# EAGLE design SandeepEtchASketch (EAGLE 9.6.2)
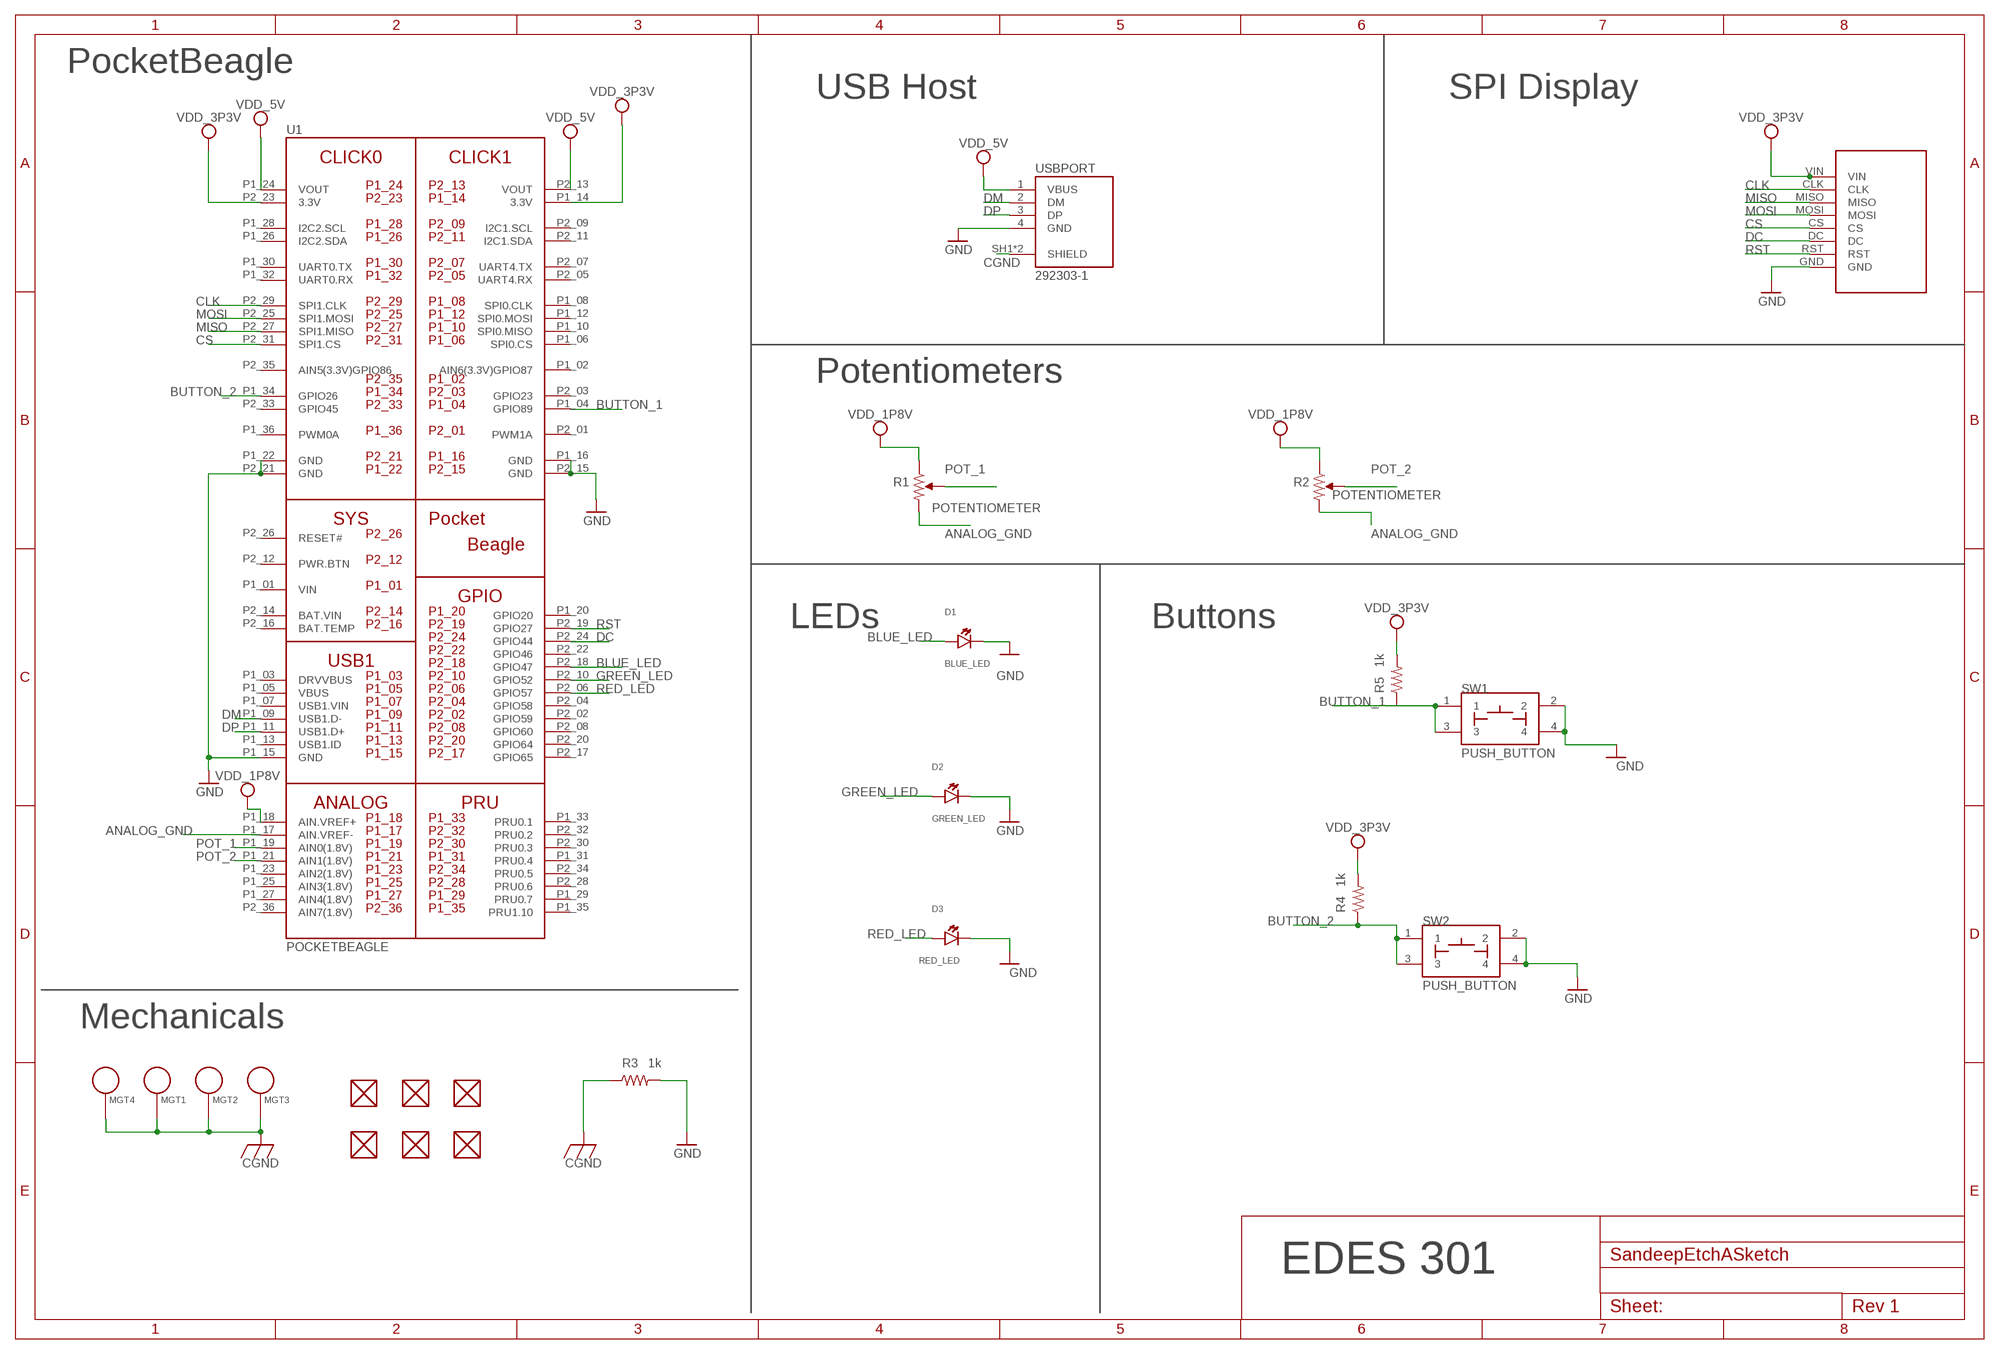
[diagram p0: schematic, sheet 1]

## Parts
D1  BLUE_LED  LED  [EIA-STD]
D2  GREEN_LED  LED  [EIA-STD]
D3  RED_LED  LED  [EIA-STD]
FUD1  FIDUCIAL  [FIDUCIAL_40MIL]
FUD2  FIDUCIAL  [FIDUCIAL_40MIL]
FUD3  FIDUCIAL  [FIDUCIAL_40MIL]
FUD4  FIDUCIAL  [FIDUCIAL_40MIL]
FUD5  FIDUCIAL  [FIDUCIAL_40MIL]
FUD6  FIDUCIAL  [FIDUCIAL_40MIL]
MGT1  MOUNTING_HOLE  [MOUNTING_HOLE]
MGT2  MOUNTING_HOLE  [MOUNTING_HOLE]
MGT3  MOUNTING_HOLE  [MOUNTING_HOLE]
MGT4  MOUNTING_HOLE  [MOUNTING_HOLE]
R1  POTENTIOMETER  [POT-PO90S]
R2  POTENTIOMETER  [POT-PO90S]
R3  1k  R_R0603  [R0603]
R4  1k  R_R0603  [R0603]
R5  1k  R_R0603  [R0603]
SPIDISPLAY  SCREEN  [SCREEN]
SW1  PUSH_BUTTON  [BUTTON_12.5MM]
SW2  PUSH_BUTTON  [BUTTON_12.5MM]
U1  POCKETBEAGLE  [POCKETBEAGLE]
USBPORT  292303-1  [TE_292303-1]

## Nets
ANALOG_GND: R1.CW R2.CW U1.P1_17(AIN.VREF-)
BLUE_LED: D1.ANODE U1.P2_18(GPIO47)
BUTTON_1: R5.1 SW1.1 SW1.3 U1.P1_04(GPIO89)
BUTTON_2: R4.1 SW2.1 SW2.3 U1.P1_34(GPIO26)
CGND: MGT1.P$1 MGT2.P$1 MGT3.P$1 MGT4.P$1 R3.1 USBPORT.SH1(SHIELD) USBPORT.SH2(SHIELD)
CLK: SPIDISPLAY.CLK U1.P2_29(SPI1.CLK)
CS: SPIDISPLAY.CS U1.P2_31(SPI1.CS)
DC: SPIDISPLAY.DC U1.P2_24(GPIO44)
DM: U1.P1_09(USB1.D-) USBPORT.2(DM)
DP: U1.P1_11(USB1.D+) USBPORT.3(DP)
GND: D1.CATHODE D2.CATHODE D3.CATHODE R3.2 SPIDISPLAY.GND SW1.2 SW1.4 SW2.2 SW2.4 U1.P1_15(GND) U1.P1_16(GND) U1.P1_22(GND) U1.P2_15(GND) U1.P2_21(GND) USBPORT.4(GND)
GREEN_LED: D2.ANODE U1.P2_10(GPIO52)
MISO: SPIDISPLAY.MISO U1.P2_27(SPI1.MISO)
MOSI: SPIDISPLAY.MOSI U1.P2_25(SPI1.MOSI)
POT_1: R1.S U1.P1_19(AIN0(1.8V))
POT_2: R2.S U1.P1_21(AIN1(1.8V))
RED_LED: D3.ANODE U1.P2_06(GPIO57)
RST: SPIDISPLAY.RST U1.P2_19(GPIO27)
VDD_1P8V: R1.CCW R2.CCW U1.P1_18(AIN.VREF+)
VDD_3P3V: R4.2 R5.2 SPIDISPLAY.VIN U1.P1_14(3.3V) U1.P2_23(3.3V)
VDD_5V: U1.P1_24(VOUT) U1.P2_13(VOUT) USBPORT.1(VBUS)
Unconnected: FUD1.P$1 FUD2.P$1 FUD3.P$1 FUD4.P$1 FUD5.P$1 FUD6.P$1 U1.P1_02(AIN6(3.3V)GPIO87) U1.P1_03(DRVVBUS) U1.P1_05(VBUS) U1.P1_06(SPI0.CS) U1.P1_07(USB1.VIN) U1.P1_08(SPI0.CLK) U1.P1_10(SPI0.MISO) U1.P1_12(SPI0.MOSI) U1.P1_13(USB1.ID) U1.P1_20(GPIO20) U1.P1_23(AIN2(1.8V)) U1.P1_25(AIN3(1.8V)) U1.P1_26(I2C2.SDA) U1.P1_27(AIN4(1.8V)) U1.P1_28(I2C2.SCL) U1.P1_29(PRU0.7) U1.P1_30(UART0.TX) U1.P1_31(PRU0.4) U1.P1_32(UART0.RX) U1.P1_33(PRU0.1) U1.P1_35(PRU1.10) U1.P1_36(PWM0A) U1.P2_01(PWM1A) U1.P2_02(GPIO59) U1.P2_03(GPIO23) U1.P2_04(GPIO58) U1.P2_05(UART4.RX) U1.P2_07(UART4.TX) U1.P2_08(GPIO60) U1.P2_09(I2C1.SCL) U1.P2_11(I2C1.SDA) U1.P2_12(PWR.BTN) U1.P2_16(BAT.TEMP) U1.P2_17(GPIO65) U1.P2_20(GPIO64) U1.P2_22(GPIO46) U1.P2_26(RESET#) U1.P2_28(PRU0.6) U1.P2_30(PRU0.3) U1.P2_32(PRU0.2) U1.P2_33(GPIO45) U1.P2_34(PRU0.5) U1.P2_35(AIN5(3.3V)GPIO86) U1.P2_36(AIN7(1.8V))

## Notes on the sheet
- PocketBeagle
- USB Host | SPI Display
- Potentiometers
- LEDs | Buttons
- Mechanicals
- EDES 301

## Power pins joined to a net without a drawn wire
BAT.VIN: U1.P2_14(BAT.VIN)
VIN: U1.P1_01(VIN)

## Library data of the parts
D1-D3 = Etch_A_Sketch:LED: EIA-STD LED, LTST-C191TBKT
FUD1-FUD6 = Etch_A_Sketch:FIDUCIAL
MGT1-MGT4 = Etch_A_Sketch:MOUNTING_HOLE: Chassis Mounting Hole w/GND connection ability
R1 R2 = Etch_A_Sketch:POTENTIOMETER: Potentiometer - Examples: P090S-14T20BR10K (987-1277-ND)
R3-R5 = Etch_A_Sketch:R_: RESISTOR, American symbol
SPIDISPLAY = Etch_A_Sketch:SCREEN
SW1 SW2 = Etch_A_Sketch:PUSH_BUTTON
U1 = Etch_A_Sketch:POCKETBEAGLE
USBPORT = Etch_A_Sketch:292303-1: CONN USB RECEPT R/A TYPE A 4POS Check availability <https://pricing.snapeda.com/parts/292303-1/TE%20Connectivity/view-part?ref=eda>; AVAILABILITY: In Stock; CENTERLINE_PITCH: 2 mm[.078 in]; COMMENT: 292303-1; DESCRIPTION: Conn; Data; USB; Recept; 2.0; 4 Pos; 1 Port; Rt Angle; A Ser; Tin over Copper; EU_ROHS_COMPLIANCE: Compliant; MF: TE Connectivity; MP: 292303-1; NUMBER_OF_POSITIONS: 4; PACKAGE: None; PRICE: None; PRODUCT_TYPE: Connector; PURCHASE-URL: https://pricing.snapeda.com/search/part/292303-1/?ref=eda

## Board
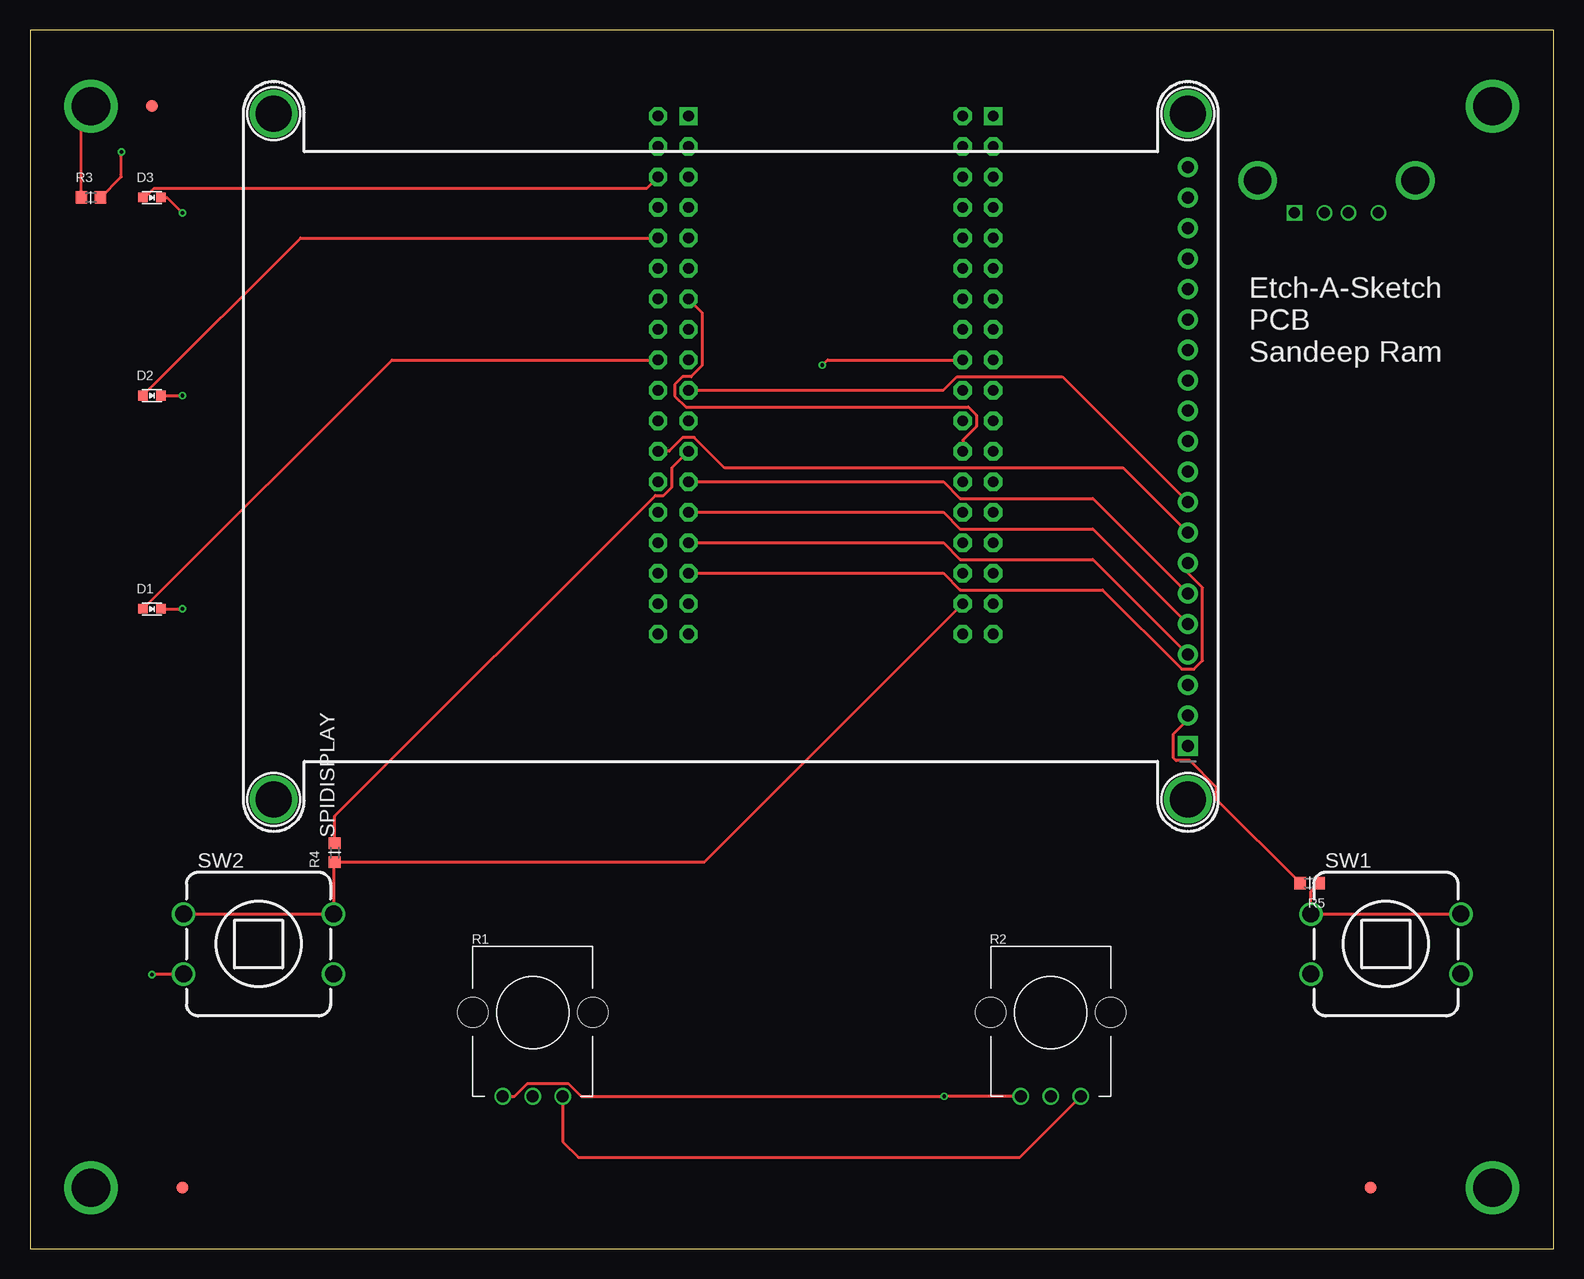
[diagram p1: board, top side]
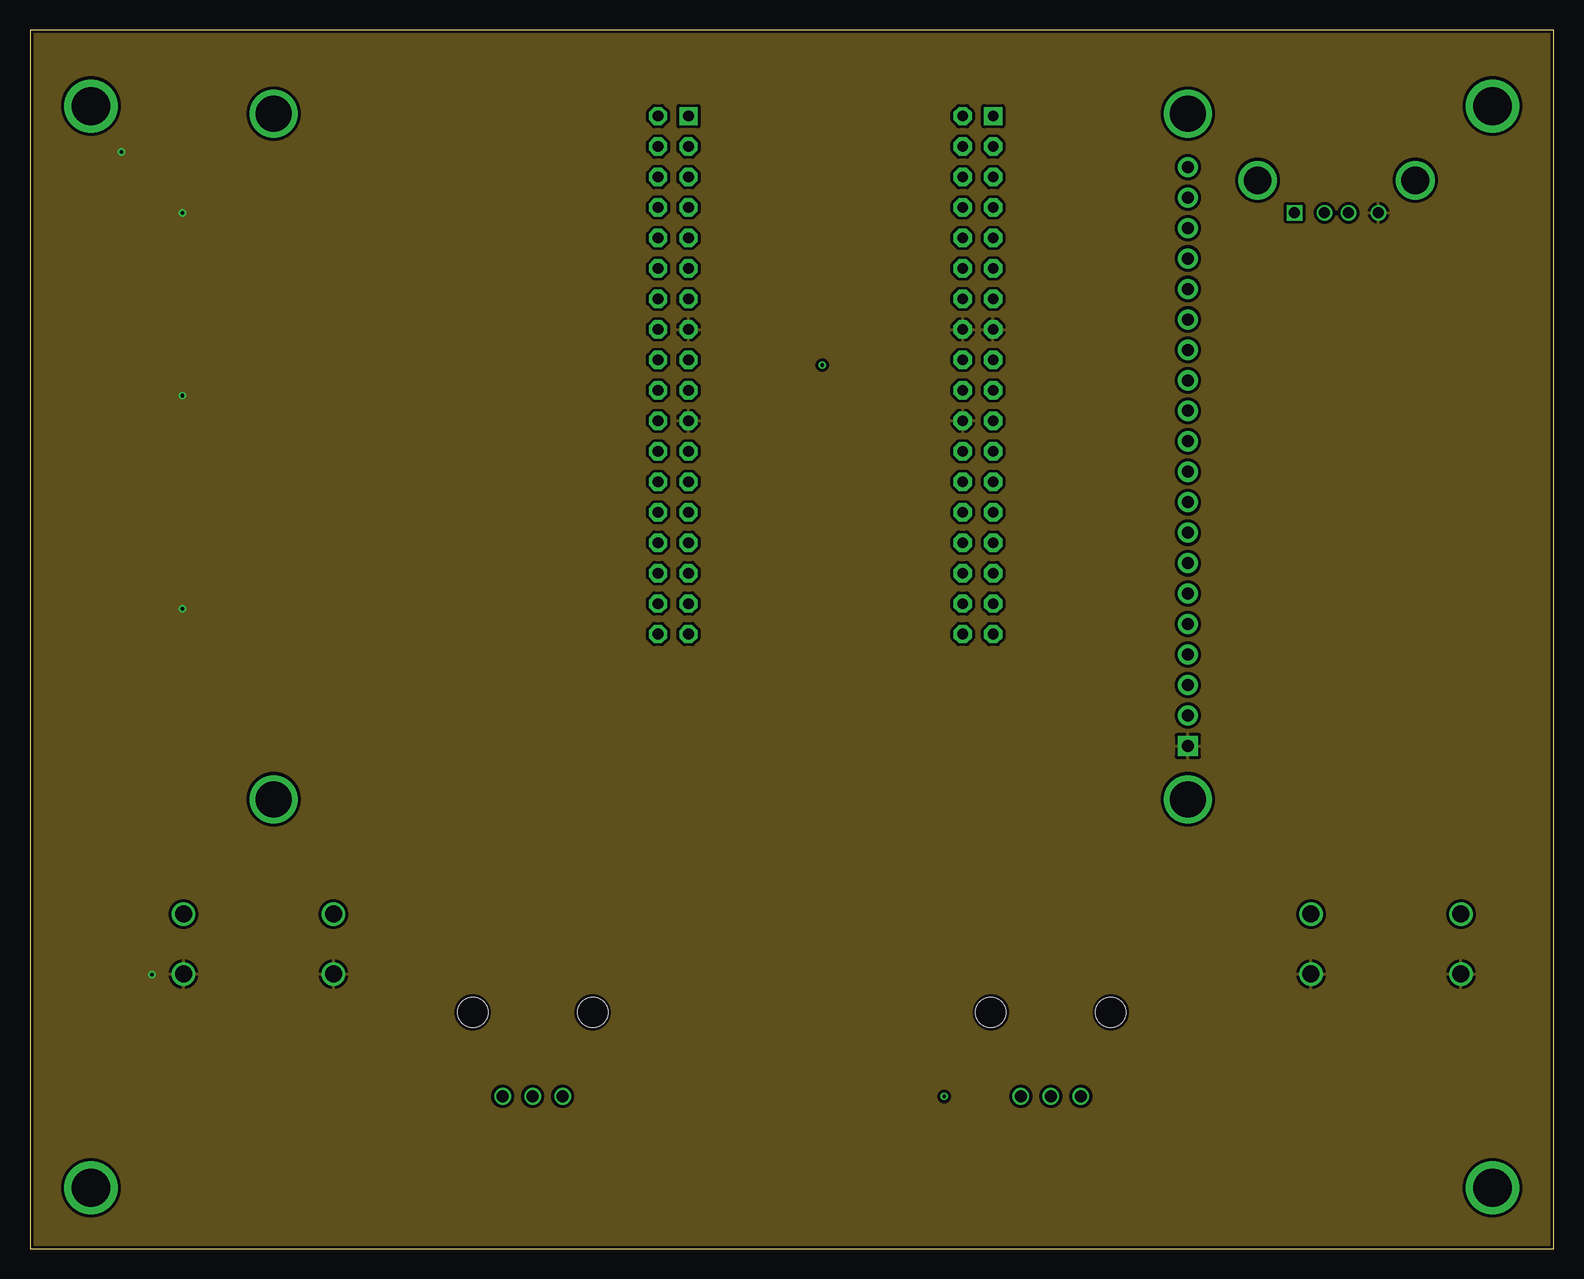
[diagram p2: board, inner layer Route2]
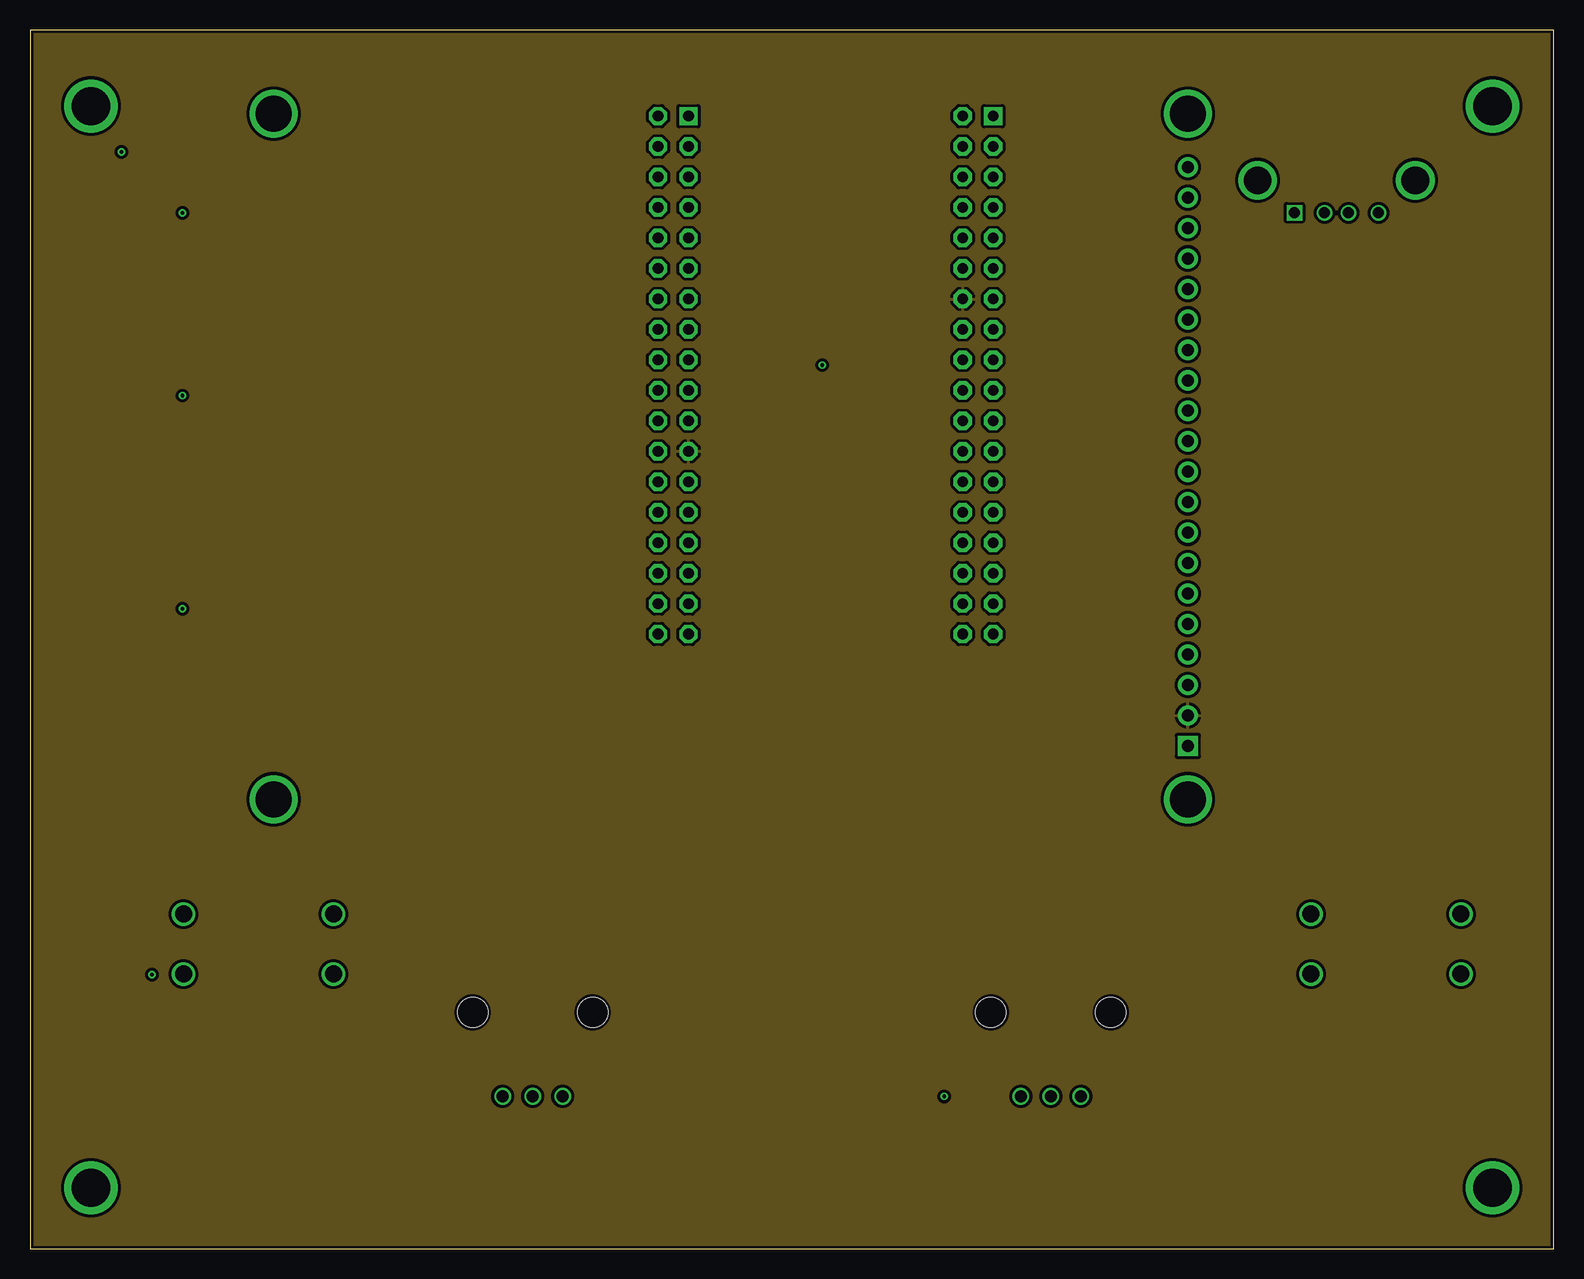
[diagram p3: board, inner layer Route15]
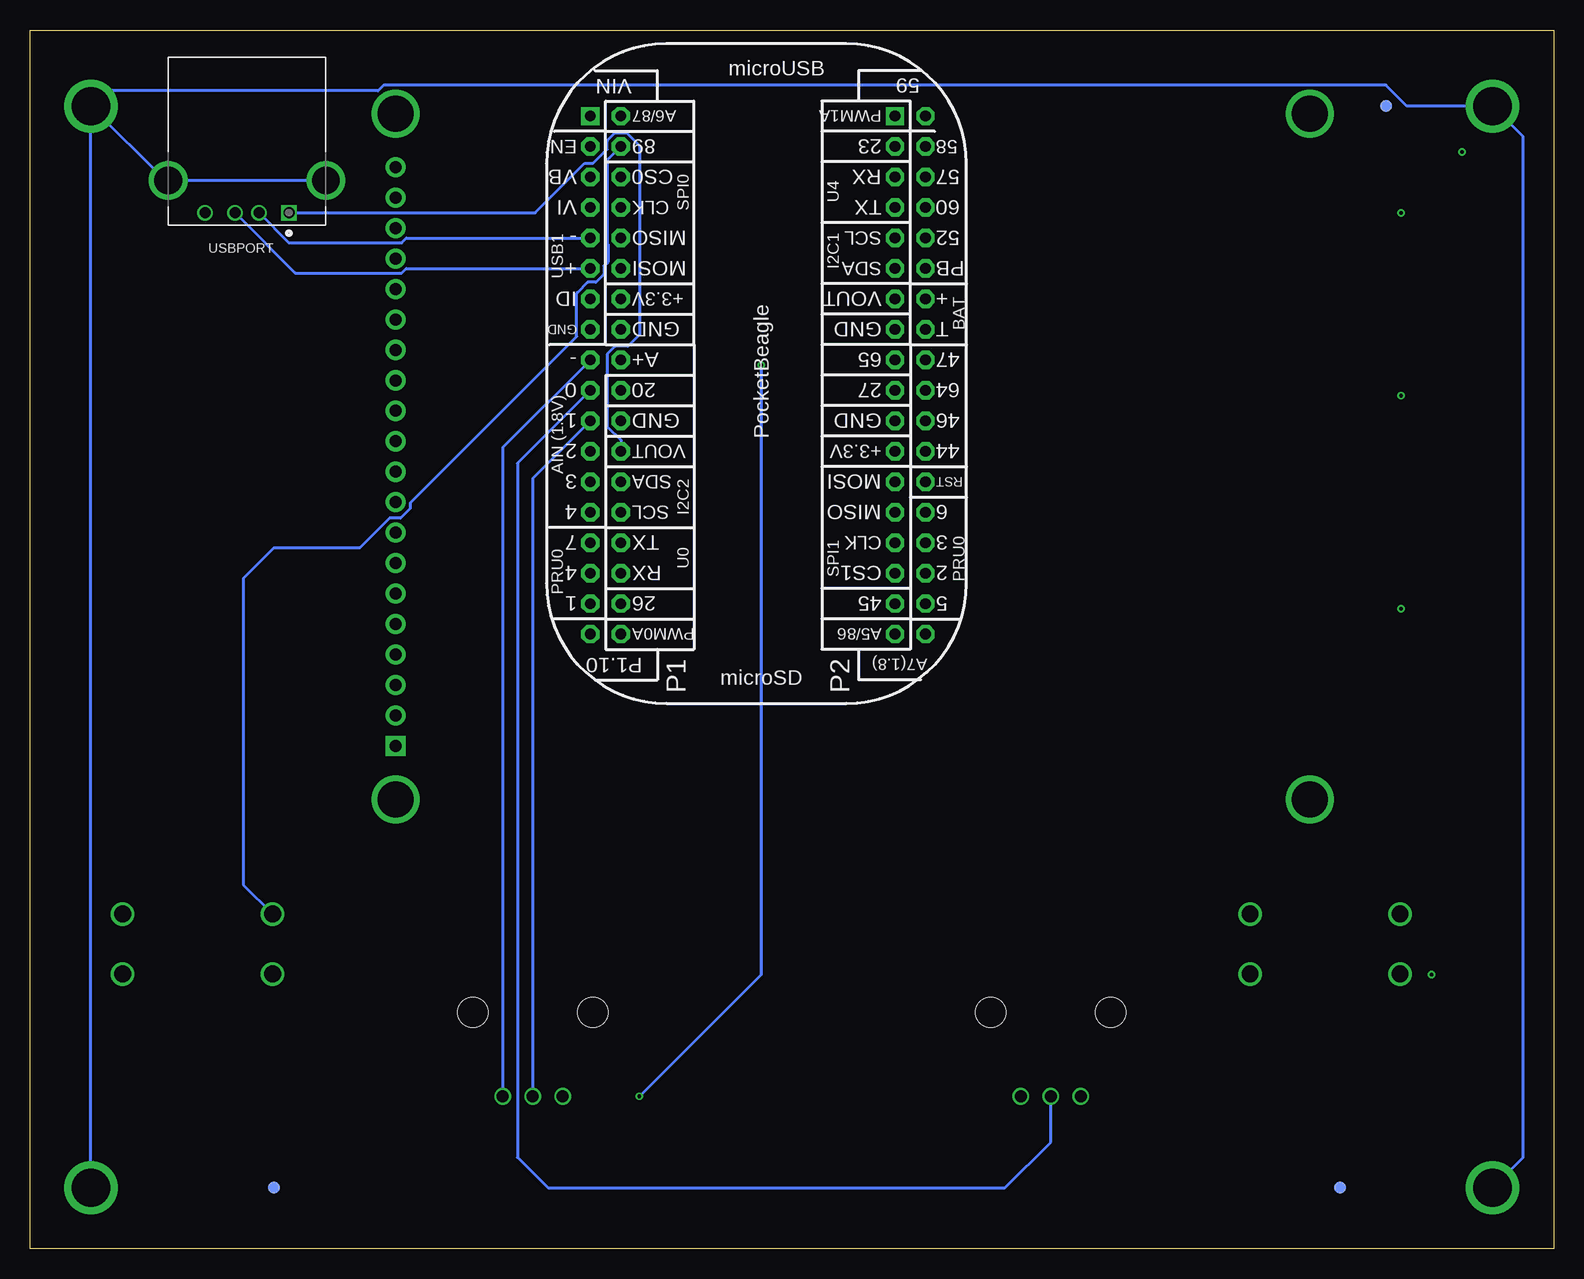
[diagram p4: board, bottom side, seen from below]

Size 127 x 101.6 mm. Coordinates in mm from the lower left corner, seen from the top.
Outline: 0,0 127,0 127,101.6 0,101.6 0,0
Copper layers (1*2*15*16): Top 0.035mm / dielectric 0.23mm / Route2 0.035mm / dielectric 0.93mm / Route15 0.035mm / dielectric 0.23mm / Bottom 0.035mm
Design rules "EDES301_4lyr": minimum track width 10mil, minimum drill 12mil, track to track 10mil, track to pad 10mil, pad to pad 10mil, via to via 10mil, smd to smd 10mil, copper to edge 10mil, drill to drill 12mil, minimum pad ring 6mil, minimum via ring 6mil, stop-mask expansion 3mil, vias tented up to drill 25mil, thermal gap 10mil

### Footprints (pad centres in the part's own frame; a part is rotated, then mirrored left to right if it is on the bottom)
EIA-STD = smd 0.8 x 0.8: ANODE -0.75,0; CATHODE 0.75,0
FIDUCIAL_40MIL = smd 1.016 x 1.016: P$1 0,0
MOUNTING_HOLE = drill 3.175 pad 4.445: P$1 0,0
POT-PO90S = drill 1: CCW -2.5,0; CW 2.5,0; S 0,0 | hole 2.5: -5,7; 5,7
R0603 = smd 0.95 x 1.031: 1 -0.8,0; 2 0.8,0
SCREEN = drill 1 pad 1.676: 3VO -19.05,-38.1; 12@JP2 3.81,-38.1; 13@JP2 6.35,-38.1; 14@JP2 8.89,-38.1; 15@JP2 11.43,-38.1; 16@JP2 13.97,-38.1; 17@JP2 16.51,-38.1; 18@JP2 19.05,-38.1; 19@JP2 21.59,-38.1; 20@JP2 24.13,-38.1; CLK -16.51,-38.1; CS -8.89,-38.1; DC -6.35,-38.1; GND@1 1.27,-38.1; LITE -1.27,-38.1; MISO -13.97,-38.1; MOSI -11.43,-38.1; RST -3.81,-38.1; VIN -21.59,-38.1 | drill 1 pad 1.676 square: GND -24.13,-38.1 | drill 3 pad 3.6: P$1@U$7 -28.575,-38.1; P$1@U$15 28.575,-38.1; P$1@U$16 -28.575,38.1; P$1@U$17 28.575,38.1
BUTTON_12.5MM = drill 1.4: 1 -6.25,2.5; 2 -6.25,-2.5; 3 6.25,2.5; 4 6.25,-2.5
POCKETBEAGLE = drill 0.889 pad 1.524 square: P1_01 5.91,3.53; P2_01 5.91,28.93 | drill 0.889 pad 1.524 octagon: P1_02 5.91,6.07; P1_03 8.45,3.53; P1_04 8.45,6.07; P1_05 10.99,3.53; P1_06 10.99,6.07; P1_07 13.53,3.53; P1_08 13.53,6.07; P1_09 16.07,3.53; P1_10 16.07,6.07; P1_11 18.61,3.53; P1_12 18.61,6.07; P1_13 21.15,3.53; P1_14 21.15,6.07; P1_15 23.69,3.53; P1_16 23.69,6.07; P1_17 26.23,3.53; P1_18 26.23,6.07; P1_19 28.77,3.53; P1_20 28.77,6.07; P1_21 31.31,3.53; P1_22 31.31,6.07; P1_23 33.85,3.53; P1_24 33.85,6.07; P1_25 36.39,3.53; P1_26 36.39,6.07; P1_27 38.93,3.53; P1_28 38.93,6.07; P1_29 41.47,3.53; P1_30 41.47,6.07; P1_31 44.01,3.53; P1_32 44.01,6.07; P1_33 46.55,3.53; P1_34 46.55,6.07; P1_35 49.09,3.53; P1_36 49.09,6.07; P2_02 5.91,31.47; P2_03 8.45,28.93; P2_04 8.45,31.47; P2_05 10.99,28.93; P2_06 10.99,31.47; P2_07 13.53,28.93; P2_08 13.53,31.47; P2_09 16.07,28.93; P2_10 16.07,31.47; P2_11 18.61,28.93; P2_12 18.61,31.47; P2_13 21.15,28.93; P2_14 21.15,31.47; P2_15 23.69,28.93; P2_16 23.69,31.47; P2_17 26.23,28.93; P2_18 26.23,31.47; P2_19 28.77,28.93; P2_20 28.77,31.47; P2_21 31.31,28.93; P2_22 31.31,31.47; P2_23 33.85,28.93; P2_24 33.85,31.47; P2_25 36.39,28.93; P2_26 36.39,31.47; P2_27 38.93,28.93; P2_28 38.93,31.47; P2_29 41.47,28.93; P2_30 41.47,31.47; P2_31 44.01,28.93; P2_32 44.01,31.47; P2_33 46.55,28.93; P2_34 46.55,31.47; P2_35 49.09,28.93; P2_36 49.09,31.47
TE_292303-1 = drill 0.92 square: 1 0,0 | drill 0.92: 2 2.5,0; 3 4.5,0; 4 7,0 | drill 2.3: SH1 -3.07,-2.71; SH2 10.07,-2.71

### Placement (x,y rotation side)
D1  10.16,53.34 0 top
D2  10.16,71.12 0 top
D3  10.16,87.63 0 top
FUD1  10.16,95.25 0 top
FUD2  111.76,5.08 0 top
FUD3  12.7,5.08 0 top
FUD4  17.78,5.08 0 bottom
FUD5  106.68,5.08 0 bottom
FUD6  13.97,95.25 0 bottom
MGT1  5.08,5.08 0 top
MGT2  121.92,5.08 0 top
MGT3  121.92,95.25 0 top
MGT4  5.08,95.25 0 top
R1  41.91,12.7 0 top
R2  85.09,12.7 0 top
R3  5.08,87.63 0 top
R4  25.4,33.02 90 top
R5  106.68,30.48 180 top
SPIDISPLAY  58.42,66.04 90 top
SW1  113.03,25.4 0 top
SW2  19.05,25.4 0 top
U1  83.82,100.33 270 bottom
USBPORT  105.41,86.36 180 bottom

### Tracks (layer width: path | path; a pad name or v marks a point on that pad's centre or on a via)
ANALOG_GND
  Top 0.254: R1.CW 44.41,8.93 45.72,7.62 82.51,7.62 R2.CW
  Bottom 0.254: U1.P1_17 87.59,66.8 R2.CW
BLUE_LED
  Top 0.254: D1.ANODE 30.17,74.1 U1.P2_18
BUTTON_1
  Top 0.254: SW1.3 SW1.1 106.78,29.78 R5.1
  Bottom 0.254: U1.P1_04 78.47,91.17 78.89,90.74 78.89,83.79 78.83,83.73 78.83,82.25 79.15,81.94 79.15,81.25 79.82,80.58 80.51,80.58 81.37,79.71 81.43,79.65 81.43,76.05 95.3,62.18 95.3,61.73 96.12,60.91 97.03,60.91 99.51,58.42 106.68,58.42 109.22,55.88 109.22,30.34 SW1.1
BUTTON_2
  Top 0.254: 25.3,27.94 25.3,32.32 R4.1 56.19,32.22 U1.P1_34 | 25.3,27.94 SW2.3 | 25.3,27.94 25.26,27.9 SW2.1
CGND
  Top 0.254: R3.1 4.28,94.45 MGT4.P$1
  Bottom 0.254: MGT1.P$1 2.54,7.62 2.54,92.71 MGT4.P$1 12.22,95.25 13.97,97 97.51,97 97.99,96.52 121.92,96.52 MGT3.P$1 | MGT2.P$1 MGT3.P$1 | MGT3.P$1 115.74,89.07 USBPORT.SH2 USBPORT.SH1
CLK
  Top 0.254: SPIDISPLAY.CLK 88.59,57.46 77.53,57.46 76.13,58.86 U1.P2_29
CS
  Top 0.254: SPIDISPLAY.CS 96.52,56.33 97.74,55.12 97.74,49.02 97.03,48.31 96.02,48.31 89.4,54.92 77.53,54.92 76.13,56.32 U1.P2_31
DC
  Top 0.254: SPIDISPLAY.DC 91.13,65.08 57.9,65.08 55.36,67.62 54.42,67.62 53.27,66.48 U1.P2_24
DM
  Bottom 0.254: U1.P1_09 95.63,84.26 96.02,83.87 105.42,83.87 USBPORT.2
DP
  Bottom 0.254: U1.P1_11 95.63,81.72 96.02,81.33 104.88,81.33 USBPORT.3
GND  (via drill 0.3 pad 0.61)
  Top 0.254: 10.75,87.63 D3.CATHODE 11.43,87.63 v12.7,86.36 | SW2.2 12.76,22.86 v10.16,22.86 | D1.CATHODE v12.7,53.34 | D2.CATHODE v12.7,71.12 | R3.2 7.62,89.37 v7.62,91.44
  pour Route2: -5.08,0 -5.08,106.68 132.08,106.68 132.08,-5.08 -5.08,-5.08
GREEN_LED
  Top 0.254: D2.ANODE 22.55,84.26 U1.P2_10
MISO
  Top 0.254: SPIDISPLAY.MISO 88.59,60 77.53,60 76.13,61.4 U1.P2_27
MOSI
  Top 0.254: SPIDISPLAY.MOSI 88.59,62.54 77.53,62.54 76.13,63.94 U1.P2_25
POT_1
  Bottom 0.254: U1.P1_19 86.08,65.77 86.36,65.49 86.36,7.62 83.82,5.08 45.72,5.08 41.91,8.89 R1.S
POT_2
  Bottom 0.254: U1.P1_21 85.09,64.22 R2.S
RED_LED
  Top 0.254: D3.ANODE 9.57,87.63 10.35,88.41 51.42,88.41 U1.P2_06
RST
  Top 0.254: SPIDISPLAY.RST 86.05,72.7 77.28,72.7 76.13,71.56 U1.P2_19
VDD_1P8V  (via drill 0.3 pad 0.61)
  Top 0.254: R2.CCW v76.2,12.7 45.94,12.7 44.86,13.78 41.46,13.78 40.38,12.7 R1.CCW | v66.04,73.66 66.48,74.1 U1.P1_18
  Bottom 0.254: v76.2,12.7 66.04,22.86 v66.04,73.66
VDD_3P3V
  Top 0.254: U1.P2_23 53.49,65.08 53.49,63.47 52.82,62.8 52.13,62.8 25.4,36.07 R4.2 | SPIDISPLAY.VIN 96.52,44.12 95.3,42.91 95.3,40.91 95.52,40.69 96.67,40.69 98.91,38.45 98.91,37.45 R5.2
  pour Route15: -7.62,-5.08 -7.62,109.22 134.62,109.22 134.62,-7.62 -7.62,-7.62
VDD_5V
  Top 0.254: U1.P2_13 56.03,78.04 56.03,73.63 55.11,72.7 54.42,72.7 53.75,72.03 53.75,71.09 54.67,70.16 78.22,70.16 78.89,69.49 78.89,68.55 77.75,67.4 U1.P1_24
  Bottom 0.254: USBPORT.1 84.89,86.36 80.76,90.48 80.07,90.48 78.89,91.66 78.89,92.35 78.22,93.02 77.28,93.02 76.2,91.95 76.2,76.2 77.16,75.24 78.22,75.24 78.89,74.57 78.89,71.12 78.89,71.09 78.89,68.55 77.75,67.4 U1.P1_24

### Text on the board
tNames: Etch-A-Sketch / PCB / Sandeep Ram